# Altium schematic sheet 03_USB_TO_UART.SchDoc: USB TO UART
size A4; Date: 20/11/2014; Author: HuangRui <vowstar@gmail.com>; DrawnBy: JiYaping <jyp1817@gmail.com>; Organization: WWW.NODEMCU.COM
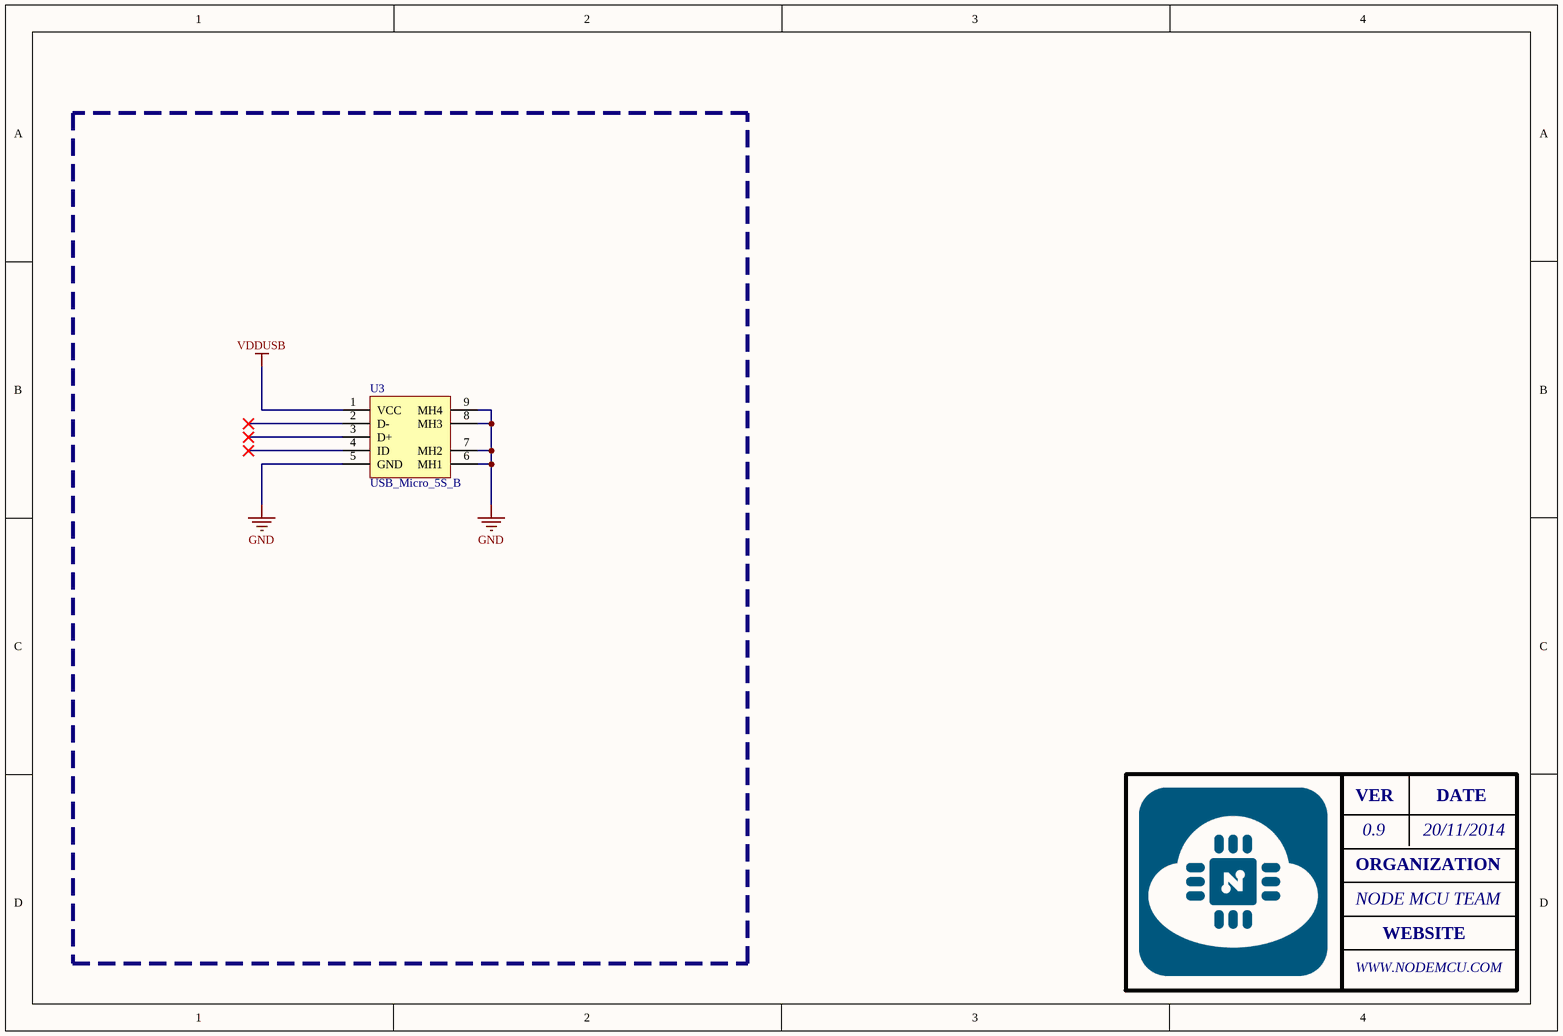
[diagram p0: 03_USB_TO_UART.SchDoc]

## Parts
U3  USB_Micro_5S_B  [USB_MICRO_5S_B]

## Nets
GND: U3.5(GND) U3.6(MH1) U3.7(MH2) U3.8(MH3) U3.9(MH4)
VDDUSB: U3.1(VCC)

Not connected (* = marked no-connect by the designer): U3 2(D-)* 3(D+)* 4(ID)*

## Notes on the sheet
- VER
- 0.9
- DATE
- ORGANIZATION
- NODE MCU TEAM
- WEBSITE

## Library data of the parts
U3 = USB_Micro_5S_B: USB micro female SMT with 4 fixed foot